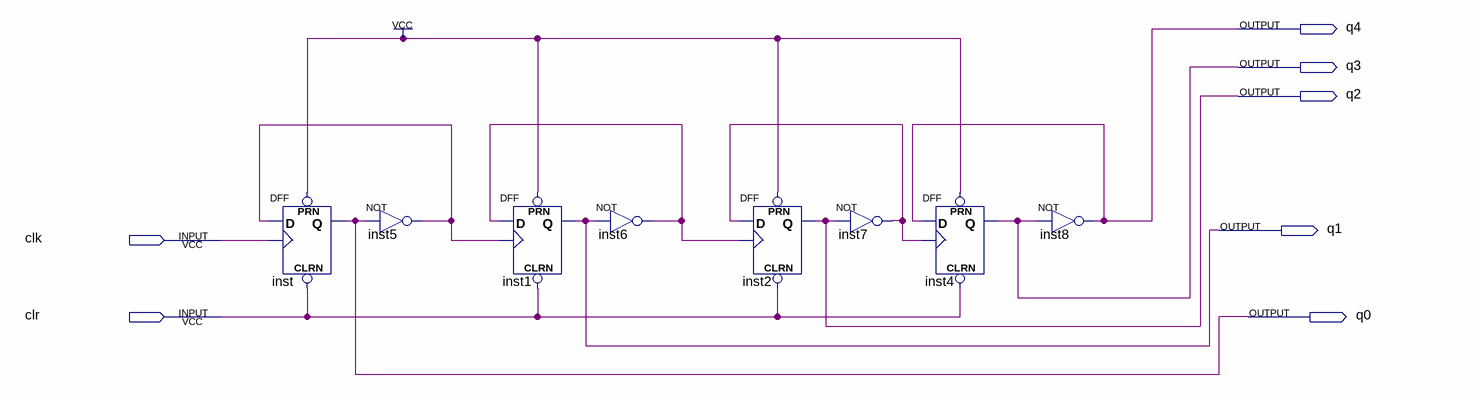
[diagram p0: schematic sheet]
// Quartus schematic mod16add1extend.bdf as structural Verilog: 8 symbols, 7 pins
module mod16add1extend (
  input  clk,
  input  clr,
  output q4,
  output q3,
  output q2,
  output q1,
  output q0
);

  wire inst5_out, inst6_out, inst7_out;

  DFF inst (.CLRN(clr), .CLK(clk), .D(inst5_out), .PRN(1'b1), .Q(q0));
  not inst5 (inst5_out, q0);
  DFF inst1 (.CLRN(clr), .CLK(inst5_out), .D(inst6_out), .PRN(1'b1), .Q(q1));
  not inst6 (inst6_out, q1);
  DFF inst2 (.CLRN(clr), .CLK(inst6_out), .D(inst7_out), .PRN(1'b1), .Q(q2));
  not inst7 (inst7_out, q2);
  DFF inst4 (.CLRN(clr), .CLK(inst7_out), .D(q4), .PRN(1'b1), .Q(q3));
  not inst8 (q4, q3);
endmodule
